# Altium schematic sheet [02] - TABLE OF CONTENTS.SchDoc: Table of Contents
size 431 x 279 mm; SheetNumber: 2; SheetTotal: 4
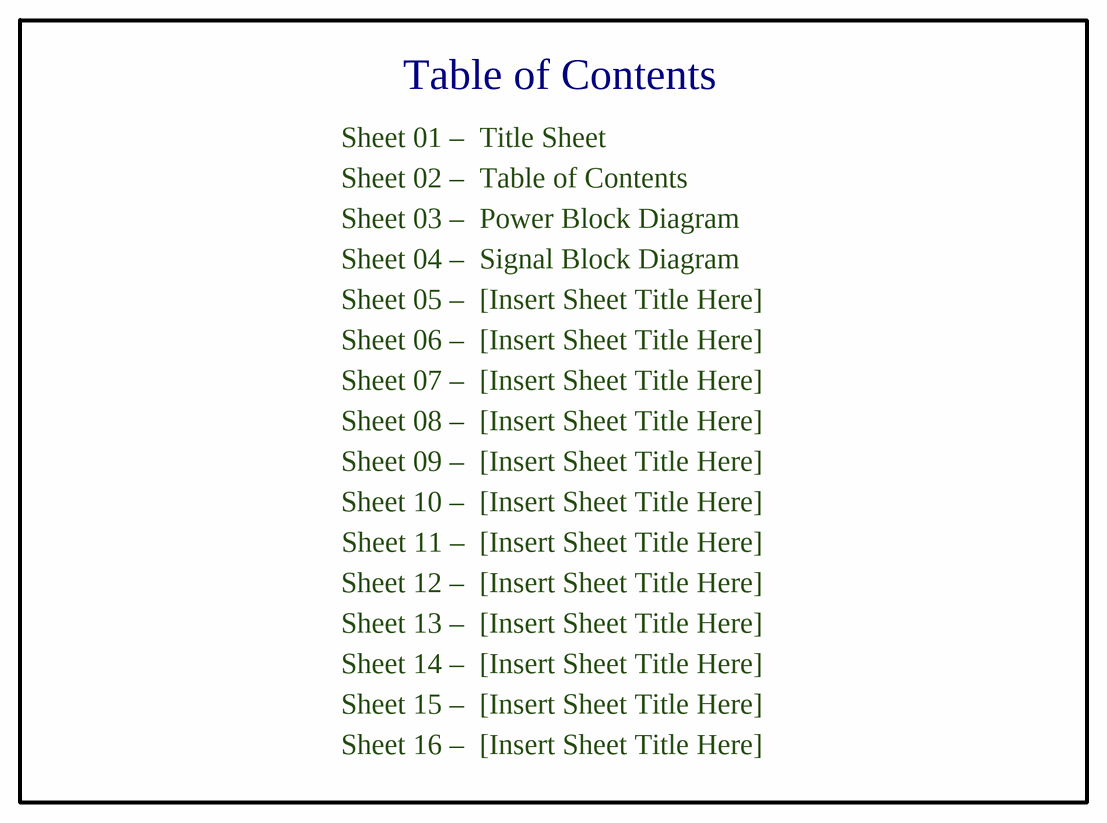
[diagram p0: [02] - TABLE OF CONTENTS.SchDoc]

## Sub-sheets
[03] - POWER BLOCK DIAGRAM = [03] - POWER BLOCK DIAGRAM.SchDoc: no entries

## Notes on the sheet
- Table of Contents
- Sheet 01 –
- Sheet 02 –
- Title Sheet
- Sheet 03 –
- Power Block Diagram
- Sheet 04 –
- Sheet 05 –
- Signal Block Diagram
- [Insert Sheet Title Here]
- Sheet 06 –
- Sheet 07 –
- Sheet 08 –
- Sheet 09 –
- Sheet 10 –
- Sheet 11 –
- Sheet 12 –
- Sheet 13 –
- Sheet 14 –
- Sheet 15 –
- Sheet 16 –
- CONFIDENTIALITY NOTICE. THIS DRAWING AND INFORMATION CONTAINED HEREIN ARE THE EXCLUSIVE PROPERTY OF [[COMPANY NAME]] NEITHER THIS DESIGN NOR ANY INFORMATION CONTAINED IN THIS DRAWING MAY BE REPRODUCED OR DISCLOSED WITHOUT THE EXPRESS WRITTEN CONSENT OF [[COMPANY NAME]].
- PCB Part Number:
- PCB Rev.:
- PCB Variant:
- Replaces PCB P/N & Rev.:
- SHEET TITLE:
- SIZE
- B
- Time Stamp:
- Doc. No.:
- Doc. Rev.:
- Doc. Status:
- Sheet
- of